# EAGLE design Dimmer (EAGLE 5.12)
REICHELT: AKL 073-02
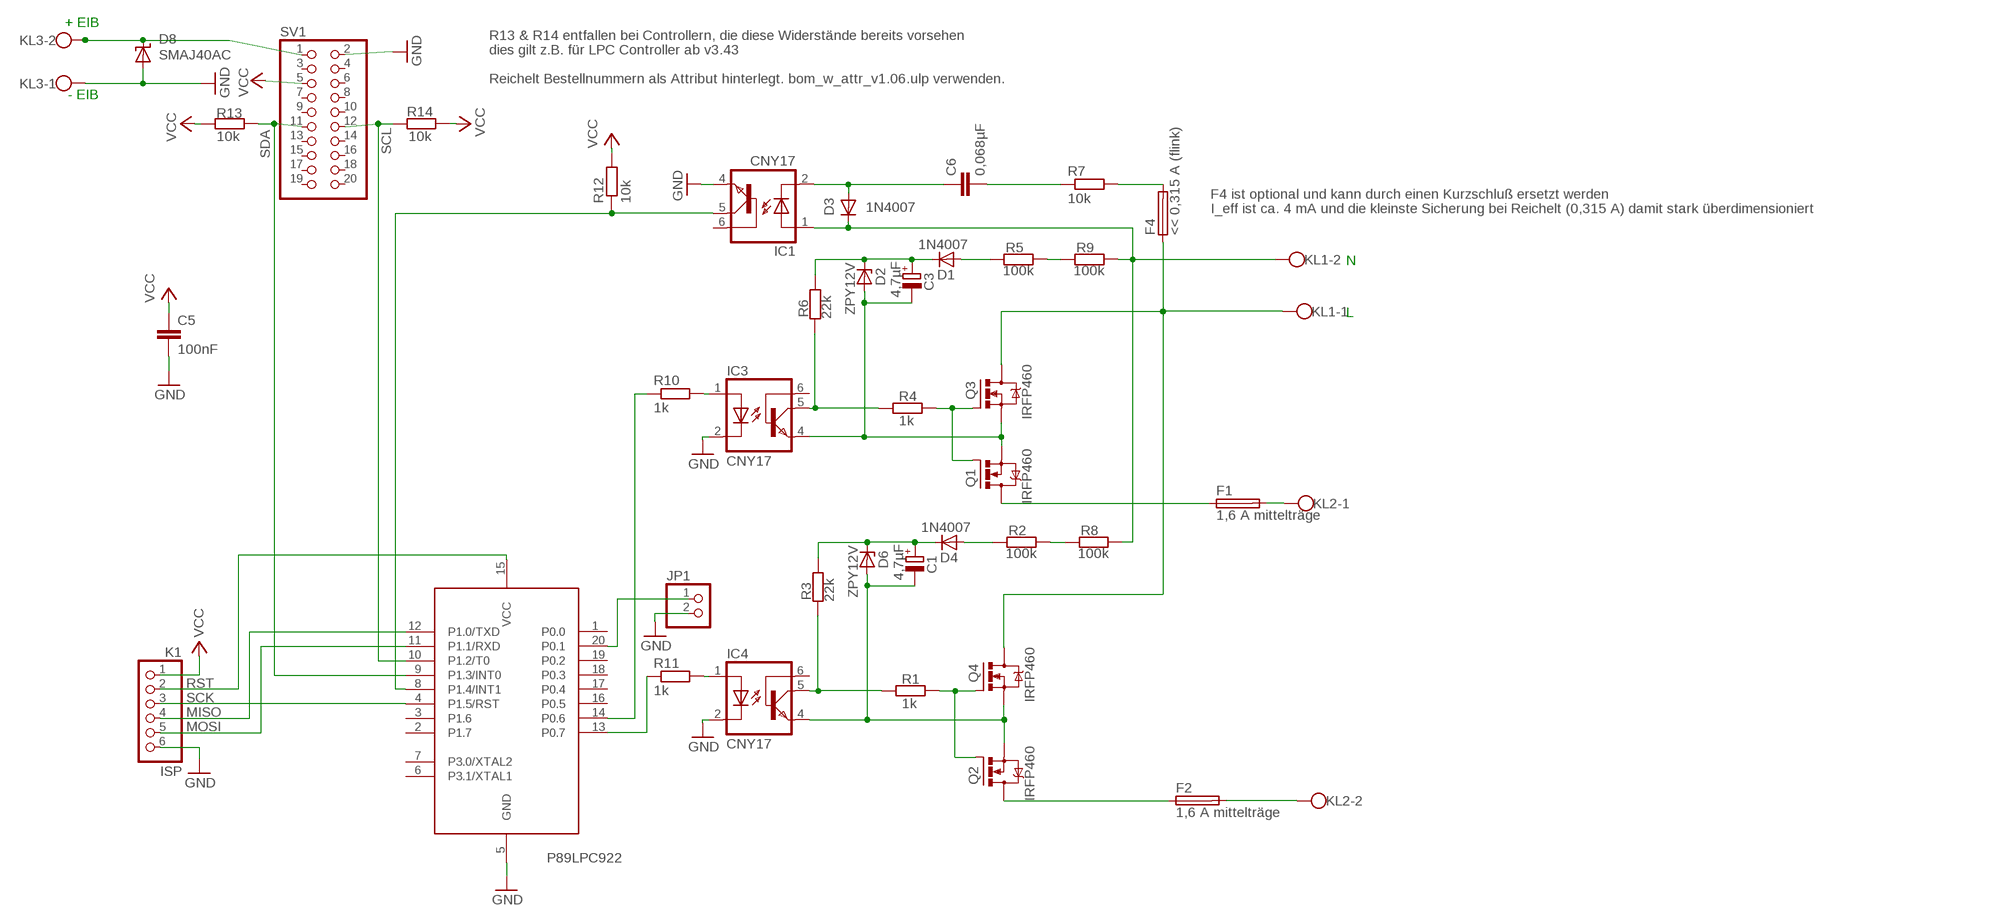
[diagram p0: schematic, sheet 1]

## Parts
C1  4,7µF  CPOL-EUE2-4  [E2-4]
C3  4,7µF  CPOL-EUE2-4  [E2-4]
C5  100nF  C-EU050-024X044  [C050-024X044]
C6  0,068µF  C-EU102-064X133  [C102-064X133]
D1  1N4007  1N4148  [DO35-10]
D2  ZPY12V  ZPY  [DO41Z10]
D3  1N4007  1N4148  [DO35-10]
D4  1N4007  1N4148  [DO35-10]
D6  ZPY12V  ZPY  [DO41Z10]
D8  SMAJ40AC  SUPPRESSOR-SMBJ  [SMBJ]
F1  1,6 A mittelträge  SH22,5  [SH22,5]
F2  1,6 A mittelträge  SH22,5  [SH22,5]
F4  << 0,315 A (flink)  TR5  [TR5]
IC1  CNY17  [DIL06]
IC2  89LPC922  [DIL20]
IC3  CNY17  [DIL06]
IC4  CNY17  [DIL06]
JP1  PINHD-1X2  [1X02]
K1  ISP  PINHD-1X6  [1X06]
KL1  W237-102  [W237-102]
KL2  W237-102  [W237-102]
KL3  W237-102  [W237-102]
Q1  IRFP460  IRFPC40  [TO247BV]
Q2  IRFP460  IRFPC40  [TO247BV]
Q3  IRFP460  IRFPC40  [TO247BV]
Q4  IRFP460  IRFPC40  [TO247BV]
R1  1k  R-EU_0204/7  [0204/7]
R2  100k  R-EU_0204/7  [0204/7]
R3  22k  R-EU_0204/7  [0204/7]
R4  1k  R-EU_0204/7  [0204/7]
R5  100k  R-EU_0204/7  [0204/7]
R6  22k  R-EU_0204/7  [0204/7]
R7  10k  R-EU_0204/7  [0204/7]
R8  100k  R-EU_0204/7  [0204/7]
R9  100k  R-EU_0204/7  [0204/7]
R10  1k  R-EU_0204/7  [0204/7]
R11  1k  R-EU_0204/7  [0204/7]
R12  10k  R-EU_0204/7  [0204/7]
R13  10k  R-EU_0204/7  [0204/7]
R14  10k  R-EU_0204/7  [0204/7]
SV1  PINHD-2X10  [2X10]

## Nets
GND: C5.2 D8.A IC1.4(EMI) IC2.5(GND) IC3.2(C) IC4.2(C) JP1.2 K1.6 KL3.1 SV1.2
MISO: IC2.12(P1.0/TXD) K1.4
MOSI: IC2.11(P1.1/RXD) K1.5
N$1: IC1.5(COL) IC2.8(P1.4/INT1) R12.1
N$2: C6.1 D3.A IC1.2(C)
N$3: D3.C IC1.1(A) KL1.2 R8.2 R9.2
N$4: IC3.1(A) R10.2
N$5: IC2.14(P0.6) R10.1
N$6: Q1.G Q3.G R4.2
N$7: IC2.13(P0.7) R11.1
N$8: F4.1 KL1.1 Q3.D Q4.D
N$9: R2.2 R8.1
N$10: R5.2 R9.1
N$12: C1.+ D4.C D6.C R3.2
N$13: C3.+ D1.C D2.C R6.2
N$14: IC4.1(A) R11.2
N$16: F2.1 Q2.D
N$17: D4.A R2.1
N$18: F1.2 KL2.1
N$19: F2.2 KL2.2
N$21: C1.- D6.A IC4.4(EMI) Q2.S Q4.S
N$22: IC4.5(COL) R1.1 R3.1
N$23: F1.1 Q1.D
N$25: IC2.20(P0.1) JP1.1
N$27: C6.2 R7.1
N$29: D1.A R5.1
N$30: C3.- D2.A IC3.4(EMI) Q1.S Q3.S
N$31: IC3.5(COL) R4.1 R6.1
N$33: Q2.G Q4.G R1.2
N$40: F4.2 R7.2
N$41: D8.C KL3.2 SV1.1
RST: IC2.15(VCC) K1.2
SCK: IC2.4(P1.5/RST) K1.3
SCL: IC2.10(P1.2/T0) R14.2 SV1.12
SDA: IC2.9(P1.3/INT0) R13.1 SV1.11
VCC: C5.1 K1.1 R12.2 R13.2 R14.1 SV1.5
Unconnected: IC1.6(BAS) IC2.1(P0.0) IC2.2(P1.7) IC2.3(P1.6) IC2.6(P3.1/XTAL1) IC2.7(P3.0/XTAL2) IC2.16(P0.5) IC2.17(P0.4) IC2.18(P0.3) IC2.19(P0.2) IC3.6(BAS) IC4.6(BAS) SV1.3 SV1.4 SV1.6 SV1.7 SV1.8 SV1.9 SV1.10 SV1.13 SV1.14 SV1.15 SV1.16 SV1.17 SV1.18 SV1.19 SV1.20

## Notes on the sheet
- + EIB
- R13 & R14 entfallen bei Controllern, die diese Widerstände bereits vorsehen
- dies gilt z.B. für LPC Controller ab v3.43
- Reichelt Bestellnummern als Attribut hinterlegt. bom_w_attr_v1.06.ulp verwenden.
- - EIB
- F4 ist optional und kann durch einen Kurzschluß ersetzt werden
- I_eff ist ca. 4 mA und die kleinste Sicherung bei Reichelt (0,315 A) damit stark überdimensioniert
- N
- L
- P89LPC922

## Library data of the parts
C1 C3 = rcl:CPOL-EU: POLARIZED CAPACITOR, European symbol
C5 C6 = rcl:C-EU: CAPACITOR, European symbol
D1 D3 D4 = diode:1N4148: DIODE high speed (Philips)
D2 D6 = diode:ZPY: Z DIODE 1 W
D8 = diode:SUPPRESSOR-: Suppressor diode
F1 F2 = fuse:SH22,5: FUSE HOLDER grid 22,5 mm, OGN0031 8201, Schurter (Buerklin); MF: SCHURTER; MPN: 0031.8201; OC_FARNELL: 1162740; OC_NEWARK: 96F8317
F4 = fuse:TR5: FUSE Wickmann; OC_FARNELL: unknown; OC_NEWARK: unknown
IC1 IC3 IC4 = optocoupler:CNY17: SIEMENS OPTO COUPLER
IC2 = micro-philips:89LPC922
JP1 = pinhead:PINHD-1X2: PIN HEADER
K1 = pinhead:PINHD-1X6: PIN HEADER
KL1-KL3 = con-wago-500:W237-102: WAGO SCREW CLAMP
Q1-Q4 = transistor-power:IRFPC40: N-CHANNEL MOS FET
R1-R14 = rcl:R-EU_: RESISTOR, European symbol
SV1 = pinhead:PINHD-2X10: PIN HEADER

## Board
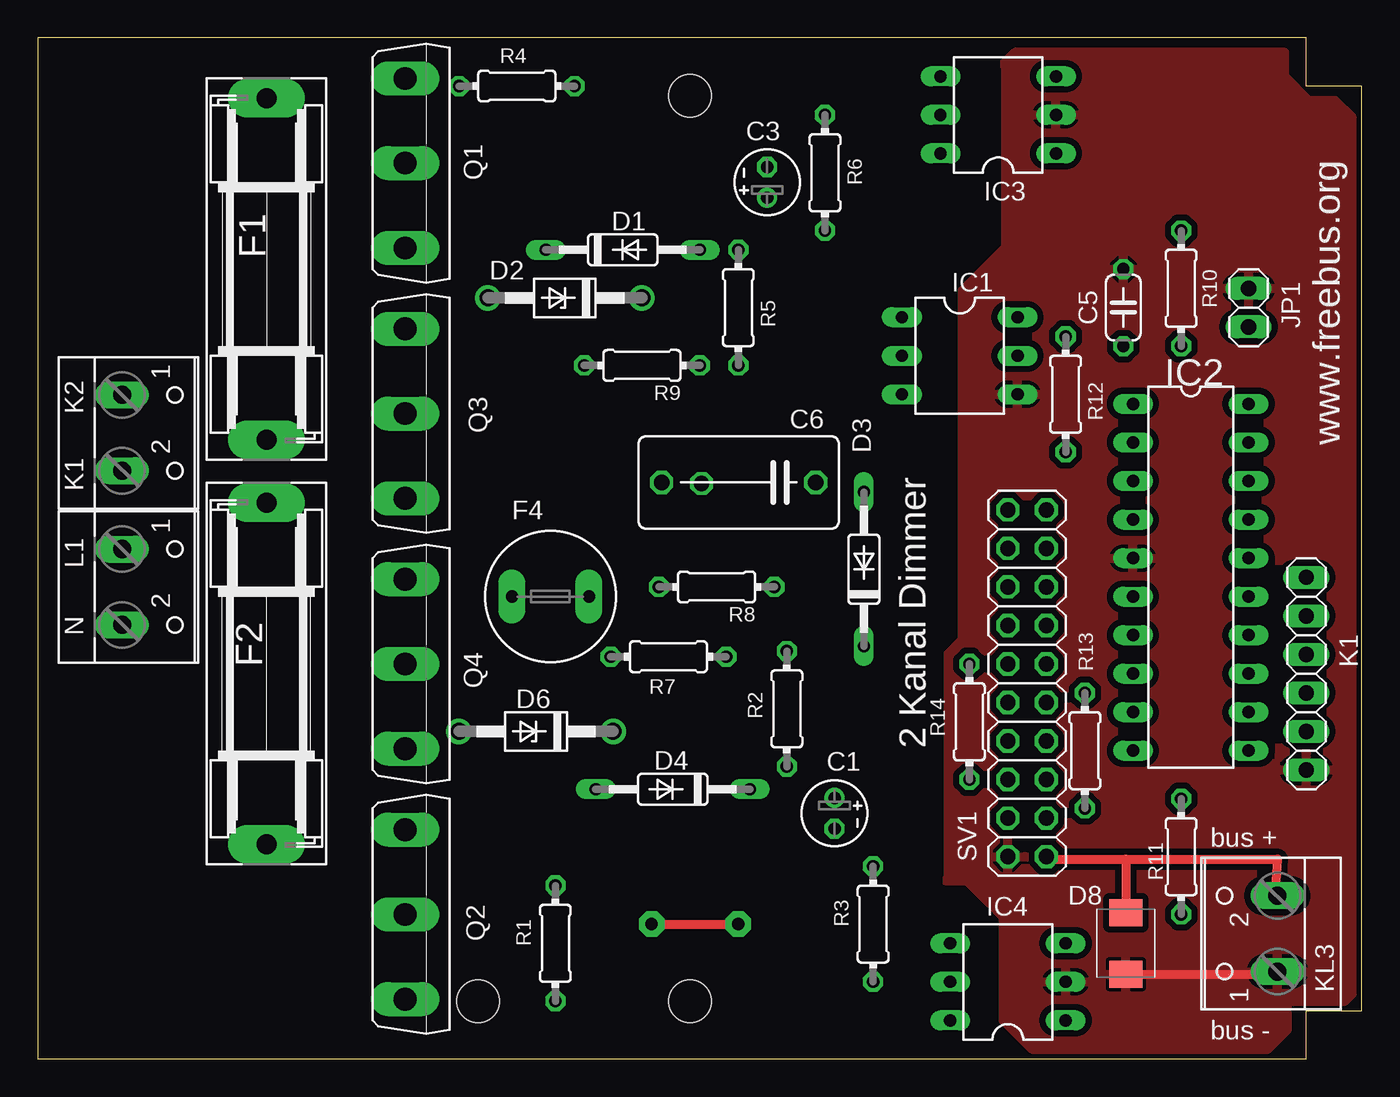
[diagram p1: board, top side]
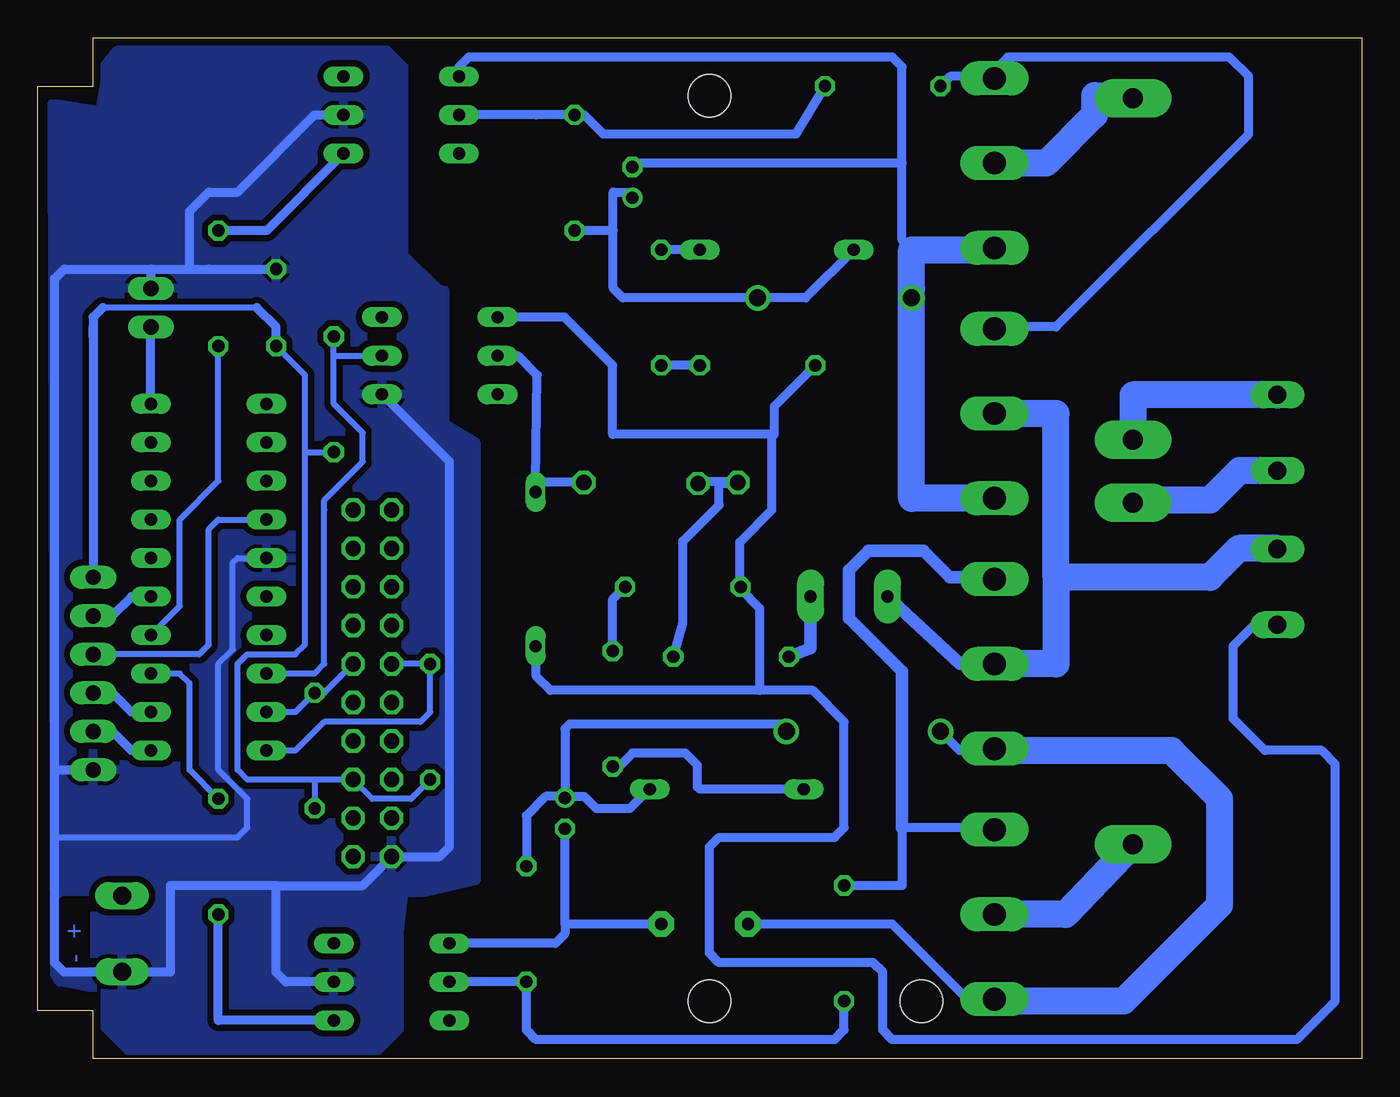
[diagram p2: board, bottom side, seen from below]

Size 87.3 x 67.31 mm. Coordinates in mm from the lower left corner, seen from the top.
Outline: 0,0.01 83.66,0 83.66,3.18 87.3,3.18 87.3,64.13 83.66,64.13 83.66,67.31 0,67.31 0,0.01
Copper layers (1*16): Top 0.035mm / dielectric 1.5mm / Bottom 0.035mm
Design rules "default *": minimum track width 10mil, minimum drill 24mil, track to track 16mil, track to pad 16mil, pad to pad 16mil, via to via 16mil, smd to smd 8mil, copper to edge 10mil, drill to drill 10mil, minimum pad ring 10mil, minimum via ring 8mil, stop-mask expansion 4mil, vias tented up to drill 0mil, thermal gap 10mil
Holes 2.8 mm at 43.02,3.81 43.02,63.5 29.04,3.81

### Footprints (pad centres in the part's own frame; a part is rotated, then mirrored left to right if it is on the bottom)
E2-4 = drill 0.813 pad 1.27 round: + -1.016,0 | drill 0.813 pad 1.27 octagon: - 1.016,0
C050-024X044 = drill 0.813 octagon: 1 -2.54,0; 2 2.54,0
C102-064X133 = drill 1.016 octagon: 1 -5.08,0; 2 5.08,0
DO35-10 = drill 0.813 long: A 5.08,0; C -5.08,0
DO41Z10 = drill 1.118 round: A 5.08,0; C -5.08,0
SMBJ = smd 1.78 x 2.16: A 2.04,0; C -2.03,0
SH22,5 = drill 1.321 pad 2.54 long: 1 -11.252,0; 2 11.252,0
TR5 = drill 0.813 pad 1.778 long: 1 -2.54,0; 2 2.54,0
DIL06 = drill 0.813 long: 1 -2.54,-3.81; 2 0,-3.81; 3 2.54,-3.81; 4 2.54,3.81; 5 0,3.81; 6 -2.54,3.81
DIL20 = drill 0.813 long: 1 -11.43,-3.81; 2 -8.89,-3.81; 3 -6.35,-3.81; 4 -3.81,-3.81; 5 -1.27,-3.81; 6 1.27,-3.81; 7 3.81,-3.81; 8 6.35,-3.81; 9 8.89,-3.81; 10 11.43,-3.81; 11 11.43,3.81; 12 8.89,3.81; 13 6.35,3.81; 14 3.81,3.81; 15 1.27,3.81; 16 -1.27,3.81; 17 -3.81,3.81; 18 -6.35,3.81; 19 -8.89,3.81; 20 -11.43,3.81
1X02 = drill 1.016 long: 1 -1.27,0; 2 1.27,0
1X06 = drill 1.016 long: 1 -6.35,0; 2 -3.81,0; 3 -1.27,0; 4 1.27,0; 5 3.81,0; 6 6.35,0
W237-102 = drill 1.194 long: 1 -2.5,-1.27; 2 2.5,-1.27
TO247BV = drill 1.499 long: D 0,-2.921; G -5.588,-2.921; S 5.588,-2.921
0204/7 = drill 0.813 octagon: 1 -3.81,0; 2 3.81,0
2X10 = drill 1.016 octagon: 1 -11.43,-1.27; 2 -11.43,1.27; 3 -8.89,-1.27; 4 -8.89,1.27; 5 -6.35,-1.27; 6 -6.35,1.27; 7 -3.81,-1.27; 8 -3.81,1.27; 9 -1.27,-1.27; 10 -1.27,1.27; 11 1.27,-1.27; 12 1.27,1.27; 13 3.81,-1.27; 14 3.81,1.27; 15 6.35,-1.27; 16 6.35,1.27; 17 8.89,-1.27; 18 8.89,1.27; 19 11.43,-1.27; 20 11.43,1.27

### Placement (x,y rotation side)
C1  52.54,16.19 270 top
C3  48.09,57.78 90 top
C5  71.59,49.53 90 top
C6  46.22,38 180 top
D1  38.57,53.34 0 top
D2  34.76,50.16 180 top
D3  54.48,32.28 90 top
D4  41.87,17.78 180 top
D6  32.85,21.59 180 top
D8  71.75,7.62 270 top
F1  15.08,52.07 270 top
F2  15.08,25.4 90 top
F4  33.81,30.48 0 top
IC1  60.8,46.35 270 top
IC2  76.03,31.75 270 top
IC3  63.34,62.23 90 top
IC4  63.97,5.08 90 top
JP1  79.84,49.53 90 top
K1  83.66,25.4 270 top
KL1  6.82,31.12 270 top
KL2  6.82,41.27 270 top
KL3  80.48,8.26 90 top
Q1  27.14,59.05 270 top
Q2  27.14,9.53 270 top
Q3  27.14,42.54 270 top
Q4  27.14,26.04 270 top
R1  34.12,7.62 90 top
R2  49.39,23.08 90 top
R3  55.08,8.89 90 top
R4  31.58,64.14 180 top
R5  46.19,49.53 270 top
R6  51.91,58.42 270 top
R7  41.59,26.51 180 top
R8  44.76,31.12 180 top
R9  39.84,45.72 180 top
R10  75.4,50.8 90 top
R11  75.4,13.33 270 top
R12  67.78,43.81 270 top
R13  69.05,20.32 270 top
R14  61.43,22.23 90 top
SV1  65.24,24.77 90 top

### Tracks (layer width: path | path; a pad name or v marks a point on that pad's centre or on a via)
GND
  Top 0.61: D8.A 82.86,5.58 82.86,5.71
  Bottom 0.406: IC2.5 74.13,33.02 74.45,32.7 74.45,26.99 75.4,26.04 75.4,19.05 73.5,17.15 73.5,15.24 74.13,14.61 86.19,14.61
  Bottom 0.61: 77.3,52.07 76.03,52.07 | 86.19,19.05 86.19,14.61 86.19,6.35 85.56,5.71 81.75,5.71 78.58,5.71 78.58,11.43 71.59,11.43 | 86.19,19.05 86.19,51.43 85.56,52.07 79.84,52.07 | 86.19,19.05 K1.6 | 77.3,52.07 C5.2 | 79.84,52.07 77.3,52.07 | 77.3,52.07 77.3,55.88 76.03,57.15 74.13,57.15 69.05,62.23 IC3.2 | 79.84,52.07 JP1.2 | 71.59,11.43 65.88,11.43 SV1.2 60.8,13.33 60.16,13.97 60.16,39.37 IC1.4 | IC4.2 70.95,5.08 71.59,5.71 71.59,11.43
  pour Top: 63.81,65.56 63.81,53.5 60.95,50.64 60.95,27.62 60,26.67 60,11.91 59.84,11.75 61.27,11.75 63.65,9.37 63.65,2.54 65.56,0.64 81.11,0.64 82.39,1.91 82.39,3.81 86.19,3.81 86.67,4.29 86.67,62.07 85.56,63.18 83.81,63.18 82.23,64.77 82.23,66.36 64.45,66.36 63.65,65.56
  pour Bottom: 82.07,66.52 64.29,66.52 63.18,65.41 63.18,53.02 60.95,50.8 60.48,50.64 60.48,41.91 58.41,40.64 58.41,11.75 61.75,10.95 63.18,10.95 63.49,8.41 63.49,1.9 64.92,0.48 81.27,0.48 82.86,2.06 82.86,4.29 82.7,4.45 85.88,5.08 86.19,5.56 86.35,61.28 86.35,63.02 83.18,62.55 82.86,64.45 82.86,65.56 82.07,66.52
MISO
  Bottom 0.61: IC2.12 81.11,22.86 82.39,24.13 K1.4
MOSI
  Bottom 0.61: IC2.11 81.11,20.32 82.39,21.59 K1.5
N$1
  Bottom 0.406: IC2.8 69.05,25.4 68.41,26.04 68.41,36.2 68.41,36.83 65.88,39.37 65.88,41.27 67.78,43.18 67.78,46.35 | 67.78,46.35 R12.1 | 67.78,46.35 IC1.5
N$2
  Bottom 0.61: IC1.2 55.64,46.35 54.38,45.09 54.48,38 | C6.1 54.48,38 | 54.48,38 D3.A
N$3
  Bottom 0.406: 41.01,31.02 41.01,31.06 R8.2
  Bottom 0.61: IC1.1 52.57,48.89 49.39,45.72 49.39,41.17 38.73,41.17 | KL1.2 7.09,28.62 8.47,27.24 8.47,22.44 6.37,20.34 2.63,20.34 1.74,19.44 1.74,3.81 4.28,1.27 30.95,1.27 31.58,1.91 31.58,5.71 32.22,6.35 42.38,6.35 43.02,6.98 43.02,13.97 42.38,14.61 34.76,14.61 34.12,15.24 34.12,22.23 36.19,24.29 39.68,24.29 | 39.68,24.29 53.49,24.29 54.45,25.24 54.45,27.18 D3.C | 39.68,24.29 39.68,29.69 41.01,31.02 41.01,34.07 38.89,36.2 38.89,41.02 38.73,41.17 | 38.73,41.17 38.89,41.12 | R9.2 38.73,43.02 38.73,41.17
N$4
  Bottom 0.61: IC3.1 72.22,54.61 R10.2
N$5
  Bottom 0.406: IC2.14 77.94,29.85 77.94,35.56 75.4,38.1 R10.1
N$6
  Bottom 0.61: 24.09,64.77 23.96,64.77 | 24.09,64.77 Q1.G | 24.09,64.77 23.96,64.9 23.96,65.41 23.33,66.04 8.73,66.04 7.46,64.77 7.46,60.96 20.15,48.26 24.09,48.26 Q3.G | 24.09,64.77 27.14,64.77 R4.2
N$7
  Bottom 0.406: IC2.13 77.94,25.4 77.3,24.77 77.3,19.05 R11.1
N$8
  Bottom 0.406: F4.1
  Bottom 0.61: Q4.D 26.5,26.04 | KL1.1 5.51,33.66 5.55,33.66
  Bottom 0.813: 26.5,26.04 30.91,30.12 F4.1
  Bottom 1.778: 20.15,31.75 20.15,42.54 Q3.D | KL1.1 5.59,33.66 8.09,33.66 10,31.75 20.15,31.75 | Q4.D 20.15,26.04 20.15,31.75
N$9
  Bottom 0.61: R8.1 49.39,30.29 R2.2
N$10
  Bottom 0.61: R9.1 R5.2
N$12
  Bottom 0.61: D6.C 38.41,22.07 52.22,22.07 52.54,21.75 C1.+ | D4.C 46.98,17.78 48.25,16.51 50.48,16.51 51.27,17.3 52.45,17.3 C1.+ | R3.2 55.08,16.03 53.81,17.3 52.63,17.3 C1.+
N$13
  Bottom 0.61: D1.C 36.66,50.16 D2.C 48.73,50.16 49.37,50.8 49.37,54.61 | 49.37,54.61 R6.2 | 49.37,54.61 49.37,57.15 48.09,57.15 C3.+
N$14
  Bottom 0.61: IC4.1 75.4,2.54 R11.2
N$16
  Bottom 1.778: F2.1 19.52,9.53 Q2.D
N$17
  Bottom 0.61: D4.A 43.65,17.78 43.81,17.94 43.81,19.37 44.6,20.16 48.09,20.16 48.99,19.27 R2.1
N$18
  Bottom 1.778: 15.08,40.64 F1.2 15.08,43.77 KL2.1
N$19
  Bottom 1.778: KL2.2 8.05,38.77 10,36.83 15.08,36.83 F2.2
N$21  (via drill 0.8 pad 1.68)
  Top 0.61: v40.48,8.89 v46.19,8.89
  Bottom 0.61: 52.54,8.89 52.54,8.26 53.17,7.62 IC4.4 | Q4.S 24.22,20.32 26.5,20.32 D6.A | 23.96,3.81 24.09,3.81 | 24.09,3.81 Q2.S | 24.09,3.81 25.87,3.81 30.95,8.89 v40.48,8.89 | v46.19,8.89 52.54,8.89 | 52.54,8.89 C1.-
  Bottom 1.778: Q4.S 24.09,20.32 12.54,20.32 9.36,17.15 9.36,10.16 15.71,3.81 23.96,3.81 24.22,3.81 Q2.S
N$22
  Bottom 0.61: R1.1 34.12,1.91 34.76,1.27 54.45,1.27 55.08,1.91 R3.1 IC4.5
N$23
  Bottom 1.778: F1.1 17.61,63.5 17.61,62.23 20.79,59.05 Q1.D
N$25
  Bottom 0.61: IC2.20 JP1.1
N$27
  Bottom 0.61: C6.2 41.2,37.94 42.38,37.94 42.38,36.51 44.76,34.13 44.76,28.73 R7.1
N$29
  Bottom 0.61: D1.A R5.1
N$30
  Bottom 0.61: IC3.4 59.52,65.41 58.89,66.04 30.95,66.04 30.31,65.41 30.31,59.05 | D2.A 30.31,51.43 | C3.- 48.09,59.05 30.31,59.05 | 30.31,59.05 30.31,53.98 29.68,53.34
  Bottom 1.778: D2.A 29.68,50.8 | Q3.S 29.68,36.96 D2.A | D2.A 29.68,53.34 23.96,53.34 23.96,53.47 24,53.47 Q1.S
N$31
  Bottom 0.61: R6.1 54.45,62.23 | R6.1 IC3.5 | R6.1 51.27,62.23 50,60.96 37.3,60.96 R4.1
N$33
  Bottom 0.61: R1.2 30.31,11.43 30.31,15.24 24.22,15.24 Q2.G | 24.22,31.75 Q4.G
  Bottom 0.813: 24.22,31.75 27.14,31.75 28.89,33.5 32.54,33.5 33.81,32.23 33.81,29.05 30.31,25.56 30.31,15.24
N$34  (via drill 1)
  other vias: 43.77,37.93
N$38
  Bottom 0.61: 41.17,38.03 43.67,38.03
N$40
  Bottom 0.813: F4.2 36.35,27.07 R7.2
N$41
  Top 0.61: 71.75,13.18 66.51,13.18 SV1.1 | KL3.2 81.59,10.75 81.75,13.18 71.75,13.18 | 71.75,13.18 D8.C
RST
  Bottom 0.61: IC2.15 81.11,30.48 82.39,29.21 K1.2
SCK
  Bottom 0.406: K1.3 76.67,26.67 76.03,27.31 76.03,34.92 75.4,35.56 IC2.4
SCL
  Bottom 0.406: SV1.12 R14.2 61.43,22.86 62.06,22.23 68.41,22.23 70.32,20.32 IC2.10
SDA
  Bottom 0.406: SV1.11 68.41,24.13 R13.1 70.32,22.86 IC2.9
VCC
  Bottom 0.406: R14.1 62.7,17.15 65.24,17.15 SV1.5 69.05,18.42 | 69.05,18.42 73.5,18.42 74.13,19.05 74.13,26.04 73.5,26.67 70.32,26.67 69.69,27.31 69.69,40 | 69.05,18.42 R13.2 | 72.86,49.53 83.02,49.53 | 69.69,40 R12.2 | 69.69,40 69.69,45.09 C5.1
  Bottom 0.61: 83.66,47.62 K1.1 | 83.66,47.62 83.66,48.26 | C5.1 71.59,48.26 72.86,49.53 | 83.02,49.53 83.66,48.89 83.66,47.62

### Text on the board
Bottom: - +
tPlace: K2 | K1 | L1 | N | bus + | bus -
tNames: www.freebus.org | 2 Kanal Dimmer